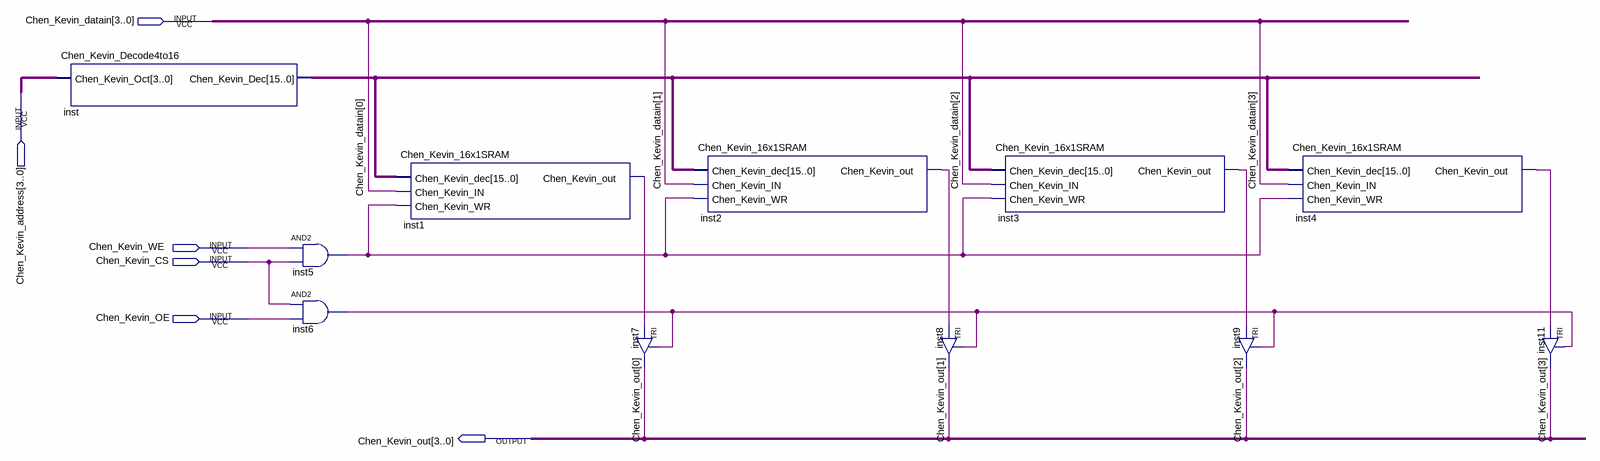
[diagram p0: schematic sheet]
// Quartus schematic Chen_Kevin_16x4SRAM.bdf as structural Verilog: 11 symbols, 6 pins
module Chen_Kevin_16x4SRAM (
  input  [3:0] Chen_Kevin_datain,
  input  [3:0] Chen_Kevin_address,
  input  Chen_Kevin_WE,
  input  Chen_Kevin_CS,
  input  Chen_Kevin_OE,
  output [3:0] Chen_Kevin_out
);

  wire inst1_chen_kevin_out, inst2_chen_kevin_out, inst3_chen_kevin_out, inst4_chen_kevin_out, inst5_out,
       inst6_out;
  wire [15:0] inst_chen_kevin_dec;

  Chen_Kevin_Decode4to16 inst (.Chen_Kevin_Oct(Chen_Kevin_address), .Chen_Kevin_Dec(inst_chen_kevin_dec));
  and inst5 (inst5_out, Chen_Kevin_WE, Chen_Kevin_CS);
  and inst6 (inst6_out, Chen_Kevin_CS, Chen_Kevin_OE);
  Chen_Kevin_16x1SRAM inst1 (
    .Chen_Kevin_dec(inst_chen_kevin_dec), .Chen_Kevin_IN(Chen_Kevin_datain[0]), .Chen_Kevin_WR(inst5_out),
    .Chen_Kevin_out(inst1_chen_kevin_out));
  TRI inst7 (.IN(inst1_chen_kevin_out), .OE(inst6_out), .OUT(Chen_Kevin_out[0]));
  Chen_Kevin_16x1SRAM inst2 (
    .Chen_Kevin_dec(inst_chen_kevin_dec), .Chen_Kevin_IN(Chen_Kevin_datain[1]), .Chen_Kevin_WR(inst5_out),
    .Chen_Kevin_out(inst2_chen_kevin_out));
  TRI inst8 (.IN(inst2_chen_kevin_out), .OE(inst6_out), .OUT(Chen_Kevin_out[1]));
  Chen_Kevin_16x1SRAM inst3 (
    .Chen_Kevin_dec(inst_chen_kevin_dec), .Chen_Kevin_IN(Chen_Kevin_datain[2]), .Chen_Kevin_WR(inst5_out),
    .Chen_Kevin_out(inst3_chen_kevin_out));
  TRI inst9 (.IN(inst3_chen_kevin_out), .OE(inst6_out), .OUT(Chen_Kevin_out[2]));
  Chen_Kevin_16x1SRAM inst4 (
    .Chen_Kevin_dec(inst_chen_kevin_dec), .Chen_Kevin_IN(Chen_Kevin_datain[3]), .Chen_Kevin_WR(inst5_out),
    .Chen_Kevin_out(inst4_chen_kevin_out));
  TRI inst11 (.IN(inst4_chen_kevin_out), .OE(inst6_out), .OUT(Chen_Kevin_out[3]));
endmodule
